# EAGLE design Main_Board_sub (EAGLE 9.7.0)
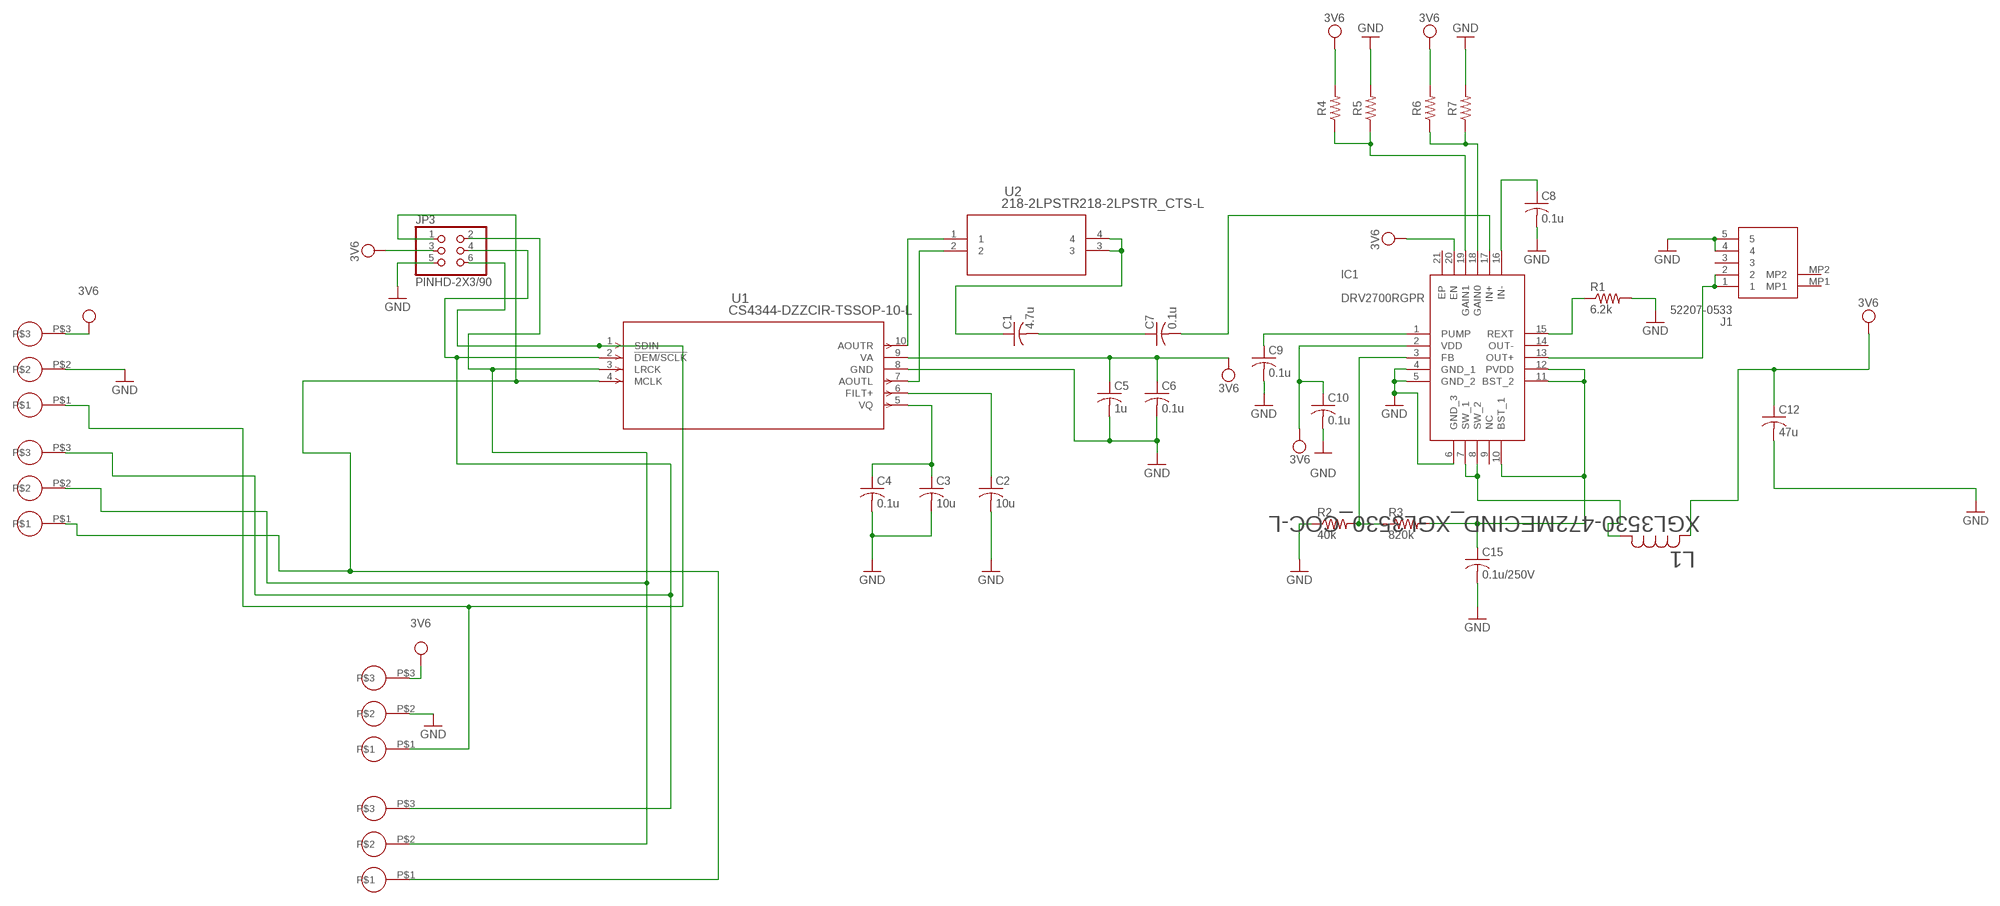
[diagram p0: schematic, sheet 1]

## Parts
C1  4.7u  C-US_CHIP-0603(1608-METRIC)  [CAPC1608X85]
C2  10u  C-US_CHIP-0603(1608-METRIC)  [CAPC1608X85]
C3  10u  C-US_CHIP-0603(1608-METRIC)  [CAPC1608X85]
C4  0.1u  C-US_CHIP-0603(1608-METRIC)  [CAPC1608X85]
C5  1u  C-US_CHIP-0603(1608-METRIC)  [CAPC1608X85]
C6  0.1u  C-US_CHIP-0603(1608-METRIC)  [CAPC1608X85]
C7  0.1u  C-US_CHIP-0603(1608-METRIC)  [CAPC1608X85]
C8  0.1u  C-US_CHIP-0603(1608-METRIC)  [CAPC1608X85]
C9  0.1u  C-US_CHIP-0603(1608-METRIC)  [CAPC1608X85]
C10  0.1u  C-US_CHIP-0603(1608-METRIC)  [CAPC1608X85]
C12  47u  C-US_CHIP-0603(1608-METRIC)  [CAPC1608X85]
C15  0.1u/250V  C-US_CHIP-1206(3216-METRIC)  [CAPC3216X135]
IC1  DRV2700RGPR  [QFN50P400X400X100-21N]
J1  52207-0533  [522070533]
JP3  PINHD-2X3/90  [2X03/90]
L1  XGL3530-472MECIND_XGL3530_COC-L  [IND_XGL3530_COC-L]
R1  6.2k  R-US_CHIP-0603(1608-METRIC)  [RESC1608X60]
R2  40k  R-US_CHIP-0603(1608-METRIC)  [RESC1608X60]
R3  820k  R-US_CHIP-0603(1608-METRIC)  [RESC1608X60]
R4  R-US_CHIP-0603(1608-METRIC)  [RESC1608X60]
R5  R-US_CHIP-0603(1608-METRIC)  [RESC1608X60]
R6  R-US_CHIP-0603(1608-METRIC)  [RESC1608X60]
R7  R-US_CHIP-0603(1608-METRIC)  [RESC1608X60]
U1  CS4344-DZZCIR-TSSOP-10-L  [CIR-TSSOP-10-L]
U2  218-2LPSTR218-2LPSTR_CTS-L  [218-2LPSTR_CTS-L]
U$1  CONECTOR_MEM  [CONECTOR_MEM]
U$2  CONECTOR_MEM  [CONECTOR_MEM]
U$3  CONECTOR_MEM  [CONECTOR_MEM]
U$4  CONECTOR_MEM  [CONECTOR_MEM]

## Nets
3V6: C5.1 C6.1 C10.1 C12.1 IC1.2(VDD) IC1.20(EN) JP3.3 L1.2 R4.2 R6.2 U1.9(VA) U$2.P$3 U$3.P$3
GND: C2.2 C3.2 C4.2 C5.2 C6.2 C8.2 C9.2 C10.2 C12.2 C15.2 IC1.4(GND_1) IC1.5(GND_2) IC1.6(GND_3) J1.4 J1.5 JP3.5 R1.2 R2.1 R5.2 R7.2 U1.8(GND) U$2.P$2 U$3.P$2
N$1: C1.1 U2.3 U2.4
N$2: C1.2 C7.1
N$3: C7.2 IC1.17(IN+)
N$4: C8.1 IC1.16(IN-)
N$5: C2.1 U1.6(FILT+)
N$6: C3.1 C4.1 U1.5(VQ)
N$7: JP3.1 U1.4(MCLK) U$1.P$1 U$4.P$1
N$11: C9.1 IC1.1(PUMP)
N$12: IC1.3(FB) R2.2 R3.1
N$13: C15.1 IC1.10(BST_1) IC1.11(BST_2) IC1.12(PVDD) R3.2
N$14: IC1.15(REXT) R1.1
N$15: IC1.7(SW_1) IC1.8(SW_2) L1.1
N$17: IC1.13(OUT+) J1.1 J1.2
N$18: IC1.18(GAIN0) R6.1 R7.1
N$19: IC1.19(GAIN1) R4.1 R5.1
N$20: U1.10(AOUTR) U2.1
N$21: U1.7(AOUTL) U2.2
N$24: JP3.2 U1.3(LRCK) U$1.P$2 U$4.P$2
N$25: JP3.4 U1.2(!DEM/SCLK) U$1.P$3 U$4.P$3
N$26: JP3.6 U1.1(SDIN) U$2.P$1 U$3.P$1
Unconnected: IC1.9(NC) IC1.14(OUT-) IC1.21(EP) J1.3 J1.MP1 J1.MP2

## Library data of the parts
C1-C10 C12 C15 = Capacitor:C-US: Capacitor - ANSI; CATEGORY: Capacitor
IC1 = DRV2700RGPR:DRV2700RGPR: DRV2700 High Voltage Driver with Integrated Boost Converter Source: Datasheet <http://www.ti.com/lit/gpn/drv2700>; DESCRIPTION: DRV2700 High Voltage Driver with Integrated Boost Converter; HEIGHT: 1mm; MANUFACTURER_NAME: Texas Instruments; MANUFACTURER_PART_NUMBER: DRV2700RGPR; MOUSER_PART_NUMBER: 595-DRV2700RGPR; MOUSER_PRICE-STOCK: https://www.mouser.co.uk/ProductDetail/Texas-Instruments/DRV2700RGPR?qs=WuTGPxIYnC4Mk9DWLhtXMw%3D%3D
J1 = 52207-0533:52207-0533: FFC & FPC Connectors 1.0 FPC ZIF 5Ckt Sn-Ag-Bi Source: Datasheet; DESCRIPTION: FFC & FPC Connectors 1.0 FPC ZIF 5Ckt Sn-Ag-Bi; HEIGHT: 2.9mm; MANUFACTURER_NAME: Molex; MANUFACTURER_PART_NUMBER: 52207-0533; MOUSER_PART_NUMBER: 538-52207-0533; MOUSER_PRICE-STOCK: https://www.mouser.co.uk/ProductDetail/Molex/52207-0533?qs=rw2VfpiI%2FsMeNRjhHQNC0g%3D%3D
JP3 = Connector:PINHD-2X3: PIN HEADER; CATEGORY: Headers; DESCRIPTION: Header, Right Angle, 2x3 Position; MANUFACTURER: Generic; MPN: Generic; OPERATING_TEMPERATURE: Generic; PART_STATUS: Active; PITCH: 0.100" (2.54mm); ROHS_COMPLIANCE: Generic; SERIES: Generic; SUB-CATEGORY: Headers, Male Pins; TYPE: Board to Board or Cable, Unshrouded, Through Hole, Right Angle
L1 = XGL3530-472MEC:XGL3530-472MEC; COPYRIGHT: Copyright (C) 2024 Ultra Librarian. All rights reserved.; MANUFACTURER_PART_NUMBER: XGL3530-472MEC; MFR_NAME: Coilcraft
R1-R3 = Tutorial - Fusion 360:R-US: Resistor Fixed - ANSI; CATEGORY: Resistor; SUB-CATEGORY: Fixed
R4-R7 = Resistor:R-US: Resistor Fixed - ANSI; CATEGORY: Resistor; SUB-CATEGORY: Fixed
U1 = CS4344:CS4344-DZZ; COPYRIGHT: Copyright (C) 2024 Ultra Librarian. All rights reserved.; MANUFACTURER_PART_NUMBER: CS4344-DZZ; MFR_NAME: Cirrus Logic
U2 = 218-2LPSTR:218-2LPSTR; COPYRIGHT: Copyright (C) 2024 Ultra Librarian. All rights reserved.; MANUFACTURER_PART_NUMBER: 218-2LPSTR; MFR_NAME: CTS Components
U$1-U$4 = CONECTOR MEM:CONECTOR_MEM

## Board
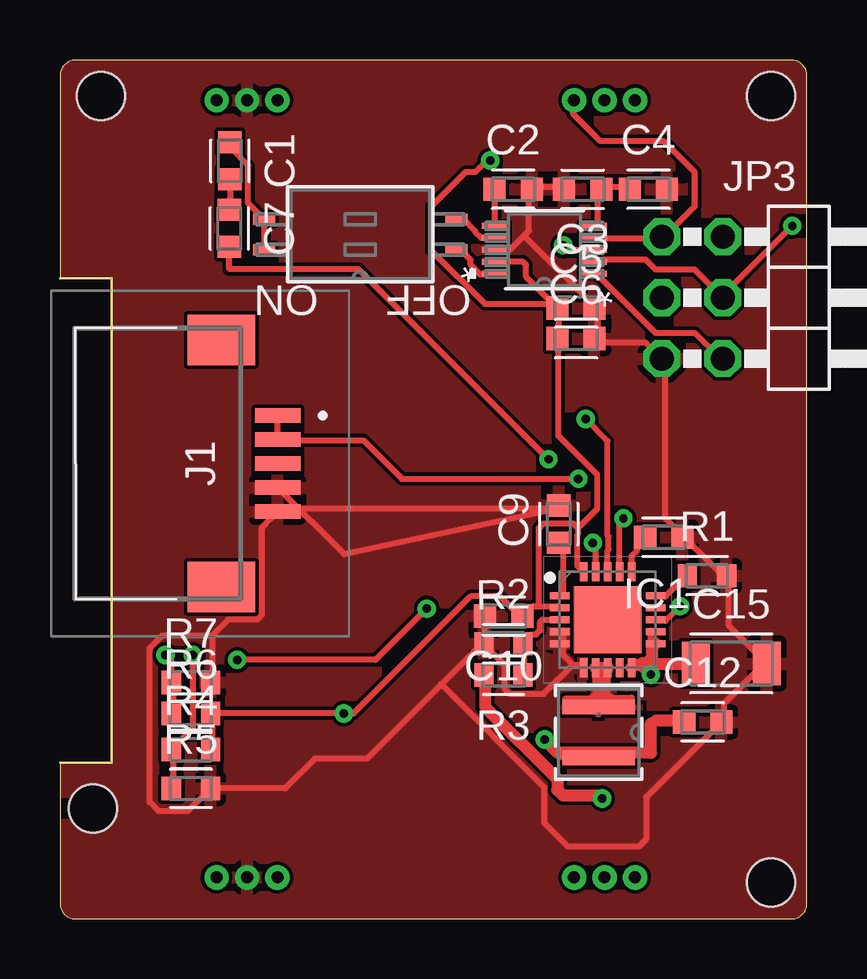
[diagram p1: board, top side]
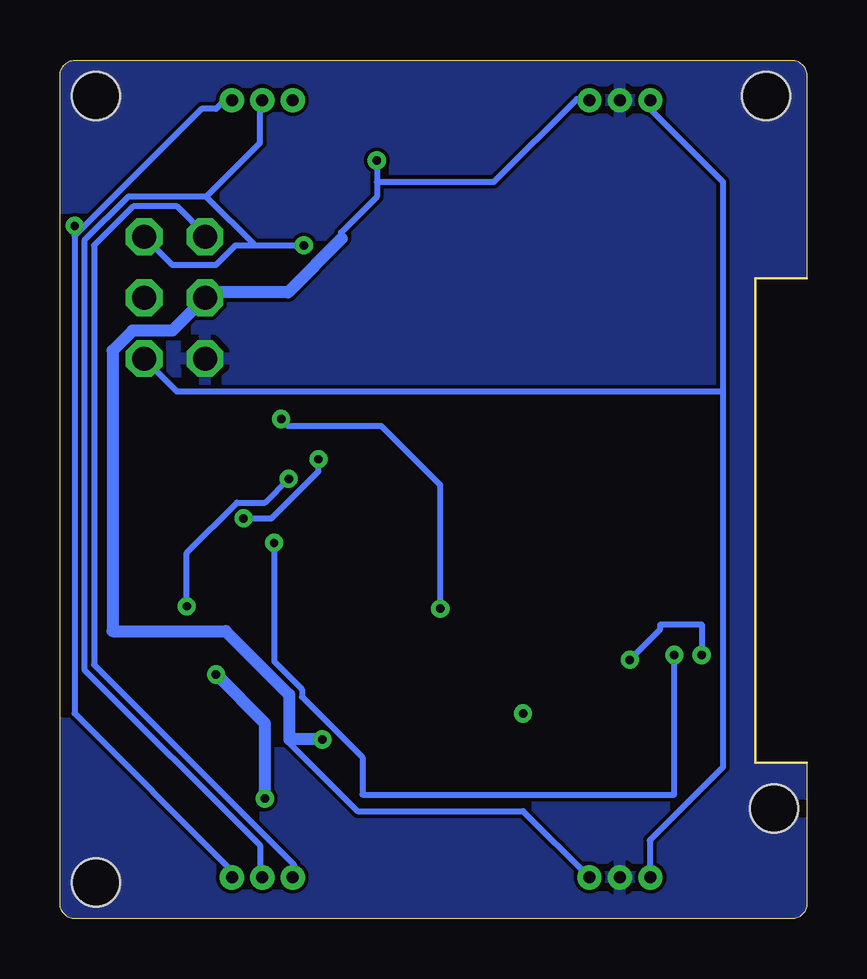
[diagram p2: board, bottom side, seen from below]

Size 31.14 x 35.79 mm. Coordinates in mm from the lower left corner, seen from the top.
Outline: 0,35.15 0,26.7 2.16,26.7 2.16,6.5 0,6.5 0,0.64 arc90 0.64,0 30.51,0 arc87 31.14,0.64 31.14,35.15 arc90 30.46,35.79 0.71,35.79 arc90 0,35.15
Copper layers (1*16): Top 0.035mm / dielectric 1.5mm / Bottom 0.035mm
Design rules "Fusion Electronics Design Rules": minimum track width 10mil, minimum drill 0.35mm, track to track 6mil, track to pad 6mil, pad to pad 6mil, via to via 6mil, smd to smd 6mil, copper to edge 1mil, drill to drill 6mil, minimum pad ring 10mil, minimum via ring 8mil, stop-mask expansion 4mil, vias tented up to drill 0mil, thermal gap 10mil
Holes 2 mm at 1.7,34.29 29.64,34.29 29.64,1.52 1.37,4.6

### Footprints (pad centres in the part's own frame; a part is rotated, then mirrored left to right if it is on the bottom)
CAPC1608X85 = smd 0.921 x 0.97: 1 -0.775,0; 2 0.775,0
CAPC3216X135 = smd 1.165 x 1.815: 1 -1.475,0; 2 1.475,0
QFN50P400X400X100-21N = smd 0.8 x 0.3: 1 -2,1; 2 -2,0.5; 3 -2,0; 4 -2,-0.5; 5 -2,-1; 11 2,-1; 12 2,-0.5; 13 2,0; 14 2,0.5; 15 2,1 | smd 0.3 x 0.8: 6 -1,-2; 7 -0.5,-2; 8 0,-2; 9 0.5,-2; 10 1,-2; 16 1,2; 17 0.5,2; 18 0,2; 19 -0.5,2; 20 -1,2 | smd 2.8 x 2.8: 21 0,0
522070533 = smd 0.6 x 1.9: 1 -2,4.225; 2 -1,4.225; 3 0,4.225; 4 1,4.225; 5 2,4.225 | smd 2.1 x 2.8: MP1 -5.15,1.875; MP2 5.15,1.875
2X03/90 = drill 1.016 octagon: 1 -2.54,-6.35; 2 -2.54,-3.81; 3 0,-6.35; 4 0,-3.81; 5 2.54,-6.35; 6 2.54,-3.81
IND_XGL3530_COC-L = smd 0.61 x 3.023: 1 -1.054,0; 2 1.054,0
RESC1608X60 = smd 0.799 x 0.974: 1 -0.815,0; 2 0.815,0
CIR-TSSOP-10-L = smd 1.105 x 0.254: 1 -2.051,1; 2 -2.051,0.5; 3 -2.051,0; 4 -2.051,-0.5; 5 -2.051,-1; 6 2.051,-1; 7 2.051,-0.5; 8 2.051,0; 9 2.051,0.5; 10 2.051,1
218-2LPSTR_CTS-L = smd 0.914 x 0.457: 1 -4.013,0.635; 2 -4.013,-0.635; 3 4.013,-0.635; 4 4.013,0.635
CONECTOR_MEM = drill 0.5: P$1 0,1.27; P$2 1.27,1.27; P$3 2.54,1.27

### Placement (x,y rotation side)
C1  7.08,31.59 270 top
C2  18.9,30.4 0 top
C3  21.79,30.4 180 top
C4  24.54,30.4 0 top
C5  21.51,25.45 0 top
C6  21.51,24.18 0 top
C7  7.06,28.78 270 top
C8  25.17,15.9 0 top
C9  20.79,16.45 90 top
C10  18.5,12.62 180 top
C12  26.8,8.2 0 top
C15  27.99,10.64 0 top
IC1  22.83,12.47 0 top
J1  4.85,18.97 270 top
JP3  31.44,25.88 270 top
L1  22.45,7.77 270 top
R1  26.97,14.3 0 top
R2  18.49,11.46 0 top
R3  18.49,10.16 180 top
R4  5.46,7.05 0 top
R5  5.46,5.44 0 top
R6  5.46,8.56 0 top
R7  5.46,9.86 0 top
U1  20.19,27.88 180 top
U2  12.52,28.52 180 top
U$1  21.44,32.84 0 top
U$2  6.53,32.84 0 top
U$3  6.53,0.46 0 top
U$4  21.44,0.46 0 top

### Tracks (layer width: path | path; a pad name or v marks a point on that pad's centre or on a via)
3V6  (via drill 0.35)
  Top 0.254: 6.35,8.56 6.35,7.14 R4.2 | C5.1 20.78,25.43 20.78,24.21 C6.1 20.78,24 20.78,20.14 22.4,18.52 22.4,17.09 21.59,16.28 | 19.96,13.03 19.76,13.03 19.35,12.62 C10.1 19.15,12.62 18.34,13.44 17.12,13.44 12.24,8.56 v11.84,8.56 6.35,8.56 | 19.96,13.03 20.78,13.03 IC1.2 | 21.59,16.28 21.39,16.48 20.17,16.48 19.96,16.28 19.96,13.03 | 6.35,8.56 R6.2 | 25.96,8.26 C12.1 | C5.1 20.57,25.63 17.71,25.63 15.49,27.85 15.49,29.69 16.92,31.11 17.32,31.11 17.87,31.66 v17.94,31.6 | 21.59,16.28 21.59,16.01 21.56,15.98 21.56,14.75 IC1.20 | C5.1 19.43,26.76 19.43,27.25 19.31,27.38 U1.9 | L1.2 20.97,6.72 20.77,6.92 | 24.85,8.26 24.75,8.26 24.64,8.15
  Top 0.508: 24.64,8.15 24.64,6.92 20.77,6.92 v20.21,7.48 | 25.96,8.26 24.85,8.26
  Bottom 0.254: v17.94,31.6 17.94,30.71 | 17.94,30.71 17.94,30.1 19.44,28.6 19.39,28.36 | U$3.P$3 11.84,4.5 18.74,4.5 21.59,7.34 21.59,7.48 | 17.94,30.71 13.05,30.71 9.6,34.16 9.19,34.16 U$2.P$3
  Bottom 0.508: 19.39,28.36 21.64,26.11 24.87,26.11 JP3.3 26.47,24.51 28.12,24.51 28.96,23.67 28.96,11.99 24.23,11.99 21.59,9.35 21.59,7.48 v20.21,7.48
GND
  Top 0.254: 20.78,17.09 9.19,17.09 J1.5 8.41,16.3 8.41,12.66 8.22,12.47 7.01,12.47 6.35,11.81 | 20.78,17.09 C9.2 | 6.35,11.81 6.35,10.01 R7.2 | 20.78,17.09 11.86,15.19 J1.4 | IC1.4 20.98,12.01 20.98,11.61 IC1.5 20.98,11.4 20.98,11 21.39,10.59 | 21.39,10.59 21.79,10.59 IC1.6 | C10.2 17.73,11.61 R2.1 | 15.9,9.78 17.53,11.4 R2.1 | 21.39,10.59 20.17,9.37 18.74,9.37 18.54,9.58 18.54,10.59 17.73,11.4 R2.1 | C3.2 20.98,30.51 19.76,30.51 C2.2 19.56,30.3 19.56,28.68 19.35,28.47 | 19.35,28.47 18.74,27.86 18.34,27.86 U1.8 | 19.35,28.47 22.2,25.63 C5.2 22.4,25.43 22.4,24.21 C6.2 22.4,24 24.43,24 25.04,23.39 JP3.5 25.25,23.19 25.25,16.69 25.86,16.08 C8.2 26.06,15.87 27.69,14.25 R1.2 27.89,14.25 27.89,12.22 29.31,10.79 C15.2 29.31,10.59 27.69,8.97 27.69,8.36 C12.2 24.45,5.08 24.45,3.33 24.13,3.01 21.18,3.01 20.2,3.99 20.2,5.47 15.9,9.78 | 6.35,11.81 4.28,11.81 3.74,11.27 3.74,4.87 4.11,4.5 5.33,4.5 6.15,5.31 R5.2 9.39,5.44 10.63,6.68 12.8,6.68 15.9,9.78
  pour Bottom: -6.38,-4.01 38.45,-4.01 41.61,-0.85 41.67,-0.79 41.7,-0.72 41.72,-0.65 41.73,-0.56 41.73,37.34 -1.5,37.34 -1.52,37.33 -1.55,37.34 -1.59,37.34 -1.6,37.34 -1.67,37.35 -1.69,37.35 -1.72,37.35 -1.74,37.36 -1.76,37.37 -1.83,37.39 -1.86,37.39 -1.88,37.4 -1.91,37.41 -1.93,37.43 -1.99,37.46 -2.02,37.47 -2.04,37.49 -2.06,37.5 -2.07,37.52 -2.12,37.56 -2.13,37.56 -2.16,37.59 -2.19,37.61 -2.2,37.63 -3.01,38.44 -9.86,31.59 -9.92,31.52 -9.95,31.45 -9.98,31.38 -9.98,31.3 -9.98,-0.58 -6.67,-3.89 -6.6,-3.95 -6.54,-3.98 -6.47,-4
  pour Top (rank 2): -20.1,-5.33 41.55,-5.33 53.9,7.02 53.96,7.09 53.99,7.15 54.02,7.22 54.02,7.31 54.02,33.7 45.1,42.63 45.03,42.68 44.97,42.72 44.89,42.74 44.81,42.75 -7.68,42.75 -7.7,42.69 -7.7,42.67 -7.71,42.64 -7.72,42.61 -7.73,42.59 -7.74,42.58 -7.76,42.55 -7.78,42.53 -7.8,42.52 -7.81,42.51 -7.84,42.49 -7.87,42.48 -7.89,42.48 -7.9,42.47 -7.94,42.47 -7.97,42.46 -7.99,42.47 -8,42.47 -8.03,42.48 -8.07,42.49 -8.08,42.5 -8.1,42.51 -8.12,42.53 -23.66,26.99 -23.71,26.92 -23.75,26.86 -23.77,26.79 -23.78,26.7 -23.78,-1.83 -20.39,-5.21 -20.32,-5.27 -20.25,-5.3 -20.18,-5.33
N$1
  Top 0.254: U2.4 U2.3 7.85,29.82 7.85,31.39 7.08,32.16 C1.1
N$2
  Top 0.254: C1.2 7.08,29.58 C7.1
N$3  (via drill 0.35)
  Top 0.254: v20.37,19.15 12.45,27.08 7.06,27.08 C7.2 | IC1.17 23.33,16.53 v23.49,16.69
  Bottom 0.254: v23.49,16.69 22.32,16.69 20.37,18.64 v20.37,19.15
N$4
  Top 0.254: C8.1 24.05,15.55 24.05,15.35 23.83,15.13 IC1.16
N$5
  Top 0.254: C2.1 18.13,30.3 U1.6
N$6
  Top 0.254: C4.1 23.62,30.51 22.61,30.51 C3.1 22.4,30.3 22.4,28.88 U1.5
N$7
  Top 0.254: U1.4 22.44,28.35 24.94,28.35 JP3.1 25.25,28.47 26.47,29.69 26.47,31.11 25.17,32.41 22.53,32.41 21.39,33.55 21.39,33.96 U$1.P$1
  Bottom 0.254: U$4.P$1 21.39,1.85 21.39,2.26 29.72,10.59 29.72,28.07 28.09,29.69 26.26,29.69 25.04,28.47 JP3.1
N$11
  Top 0.254: IC1.1 20.98,13.44 20.98,15.67 C9.1
N$12
  Top 0.254: R3.1 19.35,10.19 19.35,11.4 R2.2 19.7,11.86 19.85,11.86 20.02,12.02 20.02,12.37 20.12,12.47 IC1.3
N$13  (via drill 0.35)
  Top 0.254: 24.43,10.79 24.64,11 24.64,11.4 IC1.11 24.64,11.61 24.64,12.01 IC1.12 | 24.29,10.66 24.43,10.79 | v24.64,10.19 24.32,10.5 24.23,10.59 | R3.2 17.73,9.98 | 24.43,10.79 24.69,10.79
  Top 0.508: IC1.10 23.95,10.59 24.23,10.59 | 24.23,10.59 24.29,10.66 | IC1.11 24.69,11.33 24.69,10.79 | 24.69,10.79 24.61,10.79 24.32,10.5 | 24.69,10.79 24.69,10.24 v24.64,10.19 24.23,10.59 | 24.69,10.79 24.84,10.64 C15.1 | v22.61,5.02 22.48,5.14 20.98,5.14 20.74,5.38 20.74,5.84 17.73,8.85 17.73,9.98
  Bottom 0.254: 22.61,8.15 22.61,8.13
  Bottom 0.508: v24.64,10.19 22.61,8.15 | 22.61,8.13 v22.61,5.02
N$14
  Top 0.254: IC1.15 24.84,13.44 25.25,13.44 26.06,14.25 R1.1
N$15
  Top 0.254: IC1.8 22.81,10.39 22.45,10.39 22.4,10.39 IC1.7 22.45,10.35 22.45,9.86 | L1.1 22.11,9.17 | 22.11,9.17 21.06,9.17 21.08,9.14 22.45,9.14 | 22.11,9.17 22.44,9.5 22.45,9.5 22.68,9.27 22.91,9.27 | 22.45,9.45 22.91,8.99 23.82,8.99 23.82,9.22 23.04,9.22 22.99,9.27 22.91,9.27 | IC1.8 22.45,10.09 22.45,9.91 | IC1.8 22.83,9.35 22.91,9.27
  Top 0.508: 22.45,9.45 22.45,9.14 | 22.45,10.39 22.45,9.91 22.45,9.86 22.45,9.5 | 22.81,10.39 22.42,10.39 IC1.7 IC1.8
  pour Top: 21.97,9.19 21.03,9.19 21.03,9.09 21.01,9.05 21,9.04 21,8.54 21.01,8.53 24.18,8.53 24.2,8.56 24.2,9.27 24.15,9.32 23.19,9.32 23.14,9.34 23.11,9.38 23.09,9.42 23.09,9.68 22.78,9.98 22.22,9.98 22.22,9.45 22.2,9.4 22.02,9.21
N$17  (via drill 0.35)
  Top 0.254: v25.86,13.03 25.25,12.42 24.84,12.42 IC1.13 | J1.1 9.08,20.05 9.13,20.02 J1.2 9.11,19.94 12.65,19.94 14.25,18.33 v21.61,18.33
  Bottom 0.254: v21.61,18.33 22.59,17.35 23.76,17.35 25.86,15.26 v25.86,13.03
N$18  (via drill 0.35)
  Top 0.254: R6.1 4.72,8.56 4.72,9.8 R7.1 4.64,10.75 v4.39,11 | v21.92,20.83 22.83,19.91 22.83,15.98 22.87,15.94 22.87,15.4 22.83,15.36 IC1.18 | v15.29,12.93 13.16,10.79 v7.39,10.79
  Bottom 0.254: v21.92,20.83 21.64,20.55 17.75,20.55 15.29,18.08 v15.29,12.93 | v7.39,10.79 6.12,12.06 6.12,12.24 6.1,12.27 4.39,12.27 v4.39,11
N$19  (via drill 0.35)
  Top 0.254: v5.54,11 5.54,7.95 4.72,7.14 R4.1 4.72,6.93 4.72,5.51 R5.1 | IC1.19 22.33,15.56 v22.22,15.67
  Bottom 0.254: v5.54,11 5.54,5.18 18.54,5.18 18.54,6.74 21.06,9.25 21.06,9.57 22.22,10.73 v22.22,15.67
N$20
  Top 0.254: U2.1 16.89,27.69 17.12,27.46 17.12,27.25 17.53,26.85 18.13,26.85 U1.10
N$21
  Top 0.254: U1.7 17.57,28.38 17.31,28.63 17.31,28.66 16.81,29.16 U2.2
N$24  (via drill 0.35)
  Top 0.254: v20.98,28.07 21.18,27.86 22.2,27.86 U1.3
  Bottom 0.254: 23.01,28.07 23.82,28.07 24.64,27.25 26.47,27.25 27.48,28.27 JP3.2 | 23.01,28.07 v20.98,28.07 | 25.04,30.1 28.29,30.1 30.12,28.27 30.12,10.39 22.81,3.07 22.81,1.85 U$4.P$2 | 23.01,28.07 25.04,30.1 | 25.04,30.1 22.81,32.33 22.81,33.96 U$1.P$2
N$25  (via drill 0.35)
  Top 0.254: U1.2 22.4,27.46 24.43,27.46 24.84,27.05 26.47,27.05 27.48,26.03 JP3.4 27.69,26.03 v30.53,28.88
  Bottom 0.254: 30.33,28.68 25.25,33.76 24.64,33.76 24.43,33.96 24.03,33.96 U$1.P$3 | 30.33,28.68 30.53,28.47 30.53,8.56 24.03,2.06 24.03,1.85 U$4.P$3 | 30.33,28.68 v30.53,28.88
N$26
  Top 0.254: U1.1 22.4,26.85 24.84,24.41 26.47,24.41 27.48,23.39 JP3.6
  Bottom 0.254: 3.5,21.97 3.5,30.71 6.76,33.96 6.55,34.16 U$2.P$1 | 3.5,21.97 3.5,6.32 6.55,3.28 6.55,1.85 U$3.P$1 | 3.5,21.97 26.26,21.97 27.48,23.19 JP3.6